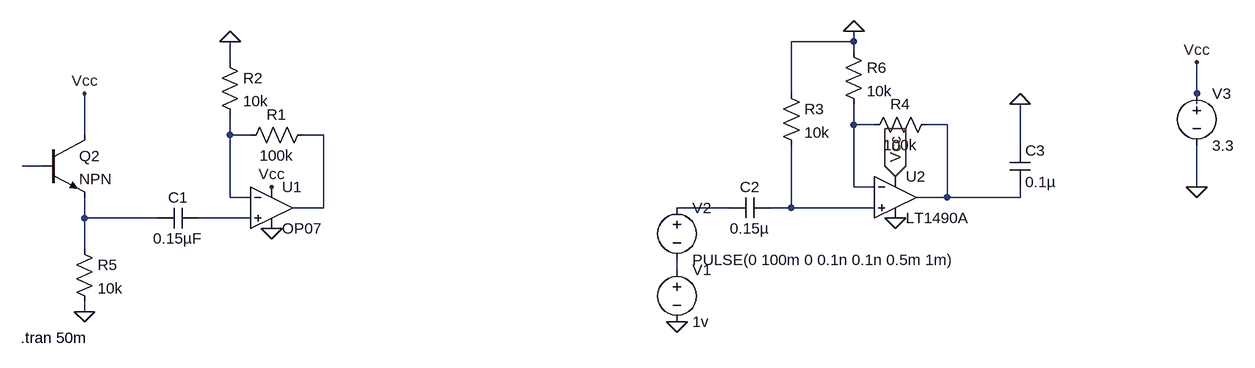
[diagram p0: schematic Draft1.asc]
Draft1.asc, the LTspice schematic file:
Version 4
SHEET 1 1056 680
WIRE 464 -96 464 -112
WIRE 464 -96 368 -96
WIRE 464 -80 464 -96
WIRE -496 -64 -496 -96
WIRE 368 -16 368 -96
WIRE 992 -16 992 -64
WIRE 992 0 992 -16
WIRE 464 32 464 0
WIRE 496 32 464 32
WIRE 608 32 576 32
WIRE -720 48 -720 -16
WIRE -496 48 -496 16
WIRE -464 48 -496 48
WIRE -352 48 -384 48
WIRE 720 64 720 0
WIRE -784 96 -816 96
WIRE 464 128 464 32
WIRE 496 128 464 128
WIRE 992 128 992 64
WIRE -496 144 -496 48
WIRE -464 144 -496 144
WIRE 608 144 608 32
WIRE 608 144 560 144
WIRE 720 144 720 128
WIRE 720 144 608 144
WIRE -352 160 -352 48
WIRE -352 160 -400 160
WIRE 272 160 192 160
WIRE 368 160 368 64
WIRE 368 160 336 160
WIRE 496 160 368 160
WIRE -720 176 -720 144
WIRE -608 176 -720 176
WIRE -464 176 -544 176
WIRE -720 224 -720 176
WIRE 192 256 192 240
WIRE -720 320 -720 304
FLAG -720 320 0
FLAG -720 -16 Vcc
FLAG -432 128 Vcc
FLAG -432 192 0
FLAG -496 -96 0
FLAG 464 -112 0
FLAG 192 336 0
FLAG 992 128 0
FLAG 992 -64 Vcc
FLAG 528 176 0
FLAG 528 112 Vcc
IOPIN 528 112 In
FLAG 720 0 0
SYMBOL npn -784 48 R0
SYMATTR InstName Q2
SYMBOL res -736 208 R0
SYMATTR InstName R5
SYMATTR Value 10k
SYMBOL cap -608 192 R270
WINDOW 0 32 32 VTop 2
WINDOW 3 0 32 VBottom 2
SYMATTR InstName C1
SYMATTR Value 0.15µF
SYMBOL OpAmps\\OP07 -432 96 R0
SYMATTR InstName U1
SYMBOL res -368 32 R90
WINDOW 0 0 56 VBottom 2
WINDOW 3 32 56 VTop 2
SYMATTR InstName R1
SYMATTR Value 100k
SYMBOL res -512 -80 R0
SYMATTR InstName R2
SYMATTR Value 10k
SYMBOL res 592 16 R90
WINDOW 0 0 56 VBottom 2
WINDOW 3 32 56 VTop 2
SYMATTR InstName R4
SYMATTR Value 100k
SYMBOL res 448 -96 R0
SYMATTR InstName R6
SYMATTR Value 10k
SYMBOL voltage 192 240 R0
WINDOW 123 0 0 Left 0
WINDOW 39 0 0 Left 0
SYMATTR InstName V1
SYMATTR Value 1v
SYMBOL voltage 192 144 R0
WINDOW 123 0 0 Left 0
WINDOW 39 0 0 Left 0
SYMATTR InstName V2
SYMATTR Value PULSE(0 100m 0 0.1n 0.1n 0.5m 1m)
SYMBOL voltage 992 -32 R0
WINDOW 123 0 0 Left 0
WINDOW 39 0 0 Left 0
SYMATTR InstName V3
SYMATTR Value 3.3
SYMBOL OpAmps\\LT1490A 528 80 R0
SYMATTR InstName U2
SYMBOL cap 272 176 R270
WINDOW 0 32 32 VTop 2
WINDOW 3 0 32 VBottom 2
SYMATTR InstName C2
SYMATTR Value 0.15µ
SYMBOL res 352 -32 R0
SYMATTR InstName R3
SYMATTR Value 10k
SYMBOL cap 704 64 R0
SYMATTR InstName C3
SYMATTR Value 0.1µ
TEXT -818 360 Left 2 !.tran 50m

The netlist it stands for:
* Draft1.asc
Q2 Vcc N005 N008 0 NPN
R5 N008 0 10k
C1 N008 N009 0.15µF
XU1 N009 N003 Vcc 0 N004 LT1001  ; OP07, pins In+ In- V+ V- OUT
R1 N004 N003 100k
R2 0 N003 10k
R4 N002 N001 100k
R6 0 N001 10k
V1 N010 0 1v
V2 N006 N010 PULSE(0 100m 0 0.1n 0.1n 0.5m 1m)
V3 Vcc 0 3.3
XU2 N007 N001 Vcc 0 N002 LT1490A  ; pins In+ In- V+ V- OUT
C2 N006 N007 0.15µ
R3 0 N007 10k
C3 0 N002 0.1µ
.model NPN NPN
.model PNP PNP
.lib standard.bjt
.tran 50m
.lib LTC.lib
.backanno
.end